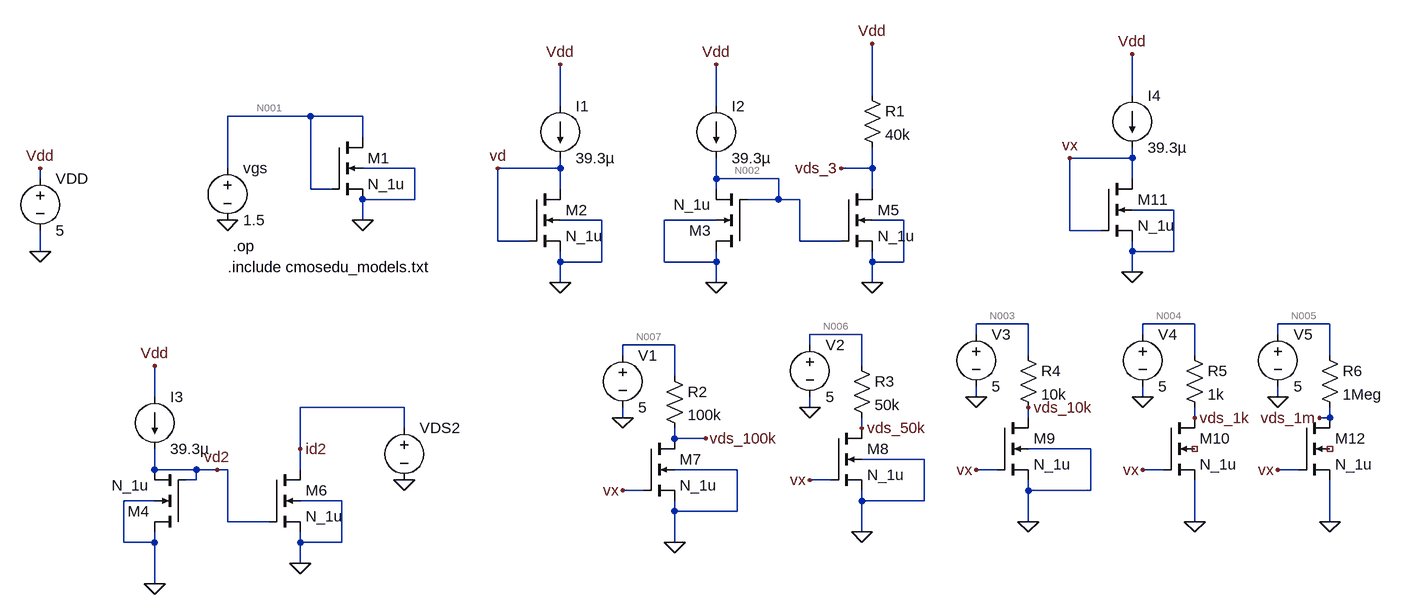
[diagram p0: schematic exe1.asc]
exe1.asc, the LTspice schematic file:
Version 4
SHEET 1 1044 680
WIRE -208 -928 -208 -1008
WIRE 192 -928 192 -992
WIRE -688 -912 -688 -976
WIRE -448 -912 -448 -976
WIRE -1072 -896 -1200 -896
WIRE -992 -896 -1072 -896
WIRE -992 -864 -992 -896
WIRE 192 -832 192 -848
WIRE 192 -832 96 -832
WIRE -1200 -816 -1200 -896
WIRE -912 -816 -992 -816
WIRE -688 -816 -688 -832
WIRE -688 -816 -784 -816
WIRE -208 -816 -208 -848
WIRE -208 -816 -256 -816
WIRE -1488 -800 -1488 -816
WIRE -448 -800 -448 -832
WIRE -352 -800 -448 -800
WIRE 192 -800 192 -832
WIRE -1072 -784 -1072 -896
WIRE -1040 -784 -1072 -784
WIRE -688 -784 -688 -816
WIRE -448 -784 -448 -800
WIRE -208 -784 -208 -816
WIRE -912 -768 -912 -816
WIRE -912 -768 -992 -768
WIRE -352 -768 -352 -800
WIRE -352 -768 -400 -768
WIRE -320 -768 -352 -768
WIRE 256 -752 192 -752
WIRE -992 -736 -992 -768
WIRE -624 -736 -688 -736
WIRE -448 -736 -528 -736
WIRE -160 -736 -208 -736
WIRE 96 -720 96 -832
WIRE 144 -720 96 -720
WIRE -784 -704 -784 -816
WIRE -736 -704 -784 -704
WIRE -320 -704 -320 -768
WIRE -256 -704 -320 -704
WIRE -1488 -688 -1488 -720
WIRE 192 -688 192 -704
WIRE 256 -688 256 -752
WIRE 256 -688 192 -688
WIRE -688 -672 -688 -688
WIRE -624 -672 -624 -736
WIRE -624 -672 -688 -672
WIRE -528 -672 -528 -736
WIRE -448 -672 -448 -688
WIRE -448 -672 -528 -672
WIRE -208 -672 -208 -688
WIRE -160 -672 -160 -736
WIRE -160 -672 -208 -672
WIRE 192 -656 192 -688
WIRE -688 -640 -688 -672
WIRE -448 -640 -448 -672
WIRE -208 -640 -208 -672
WIRE 32 -576 -48 -576
WIRE 288 -576 208 -576
WIRE 496 -576 416 -576
WIRE -224 -560 -304 -560
WIRE -48 -560 -48 -576
WIRE 208 -560 208 -576
WIRE 416 -560 416 -576
WIRE -512 -544 -592 -544
WIRE -304 -544 -304 -560
WIRE -592 -528 -592 -544
WIRE 32 -528 32 -576
WIRE 288 -528 288 -576
WIRE 496 -528 496 -576
WIRE -224 -512 -224 -560
WIRE -512 -496 -512 -544
WIRE -1312 -464 -1312 -512
WIRE -48 -464 -48 -480
WIRE 208 -464 208 -480
WIRE 416 -464 416 -480
WIRE -928 -448 -1088 -448
WIRE -304 -448 -304 -464
WIRE -592 -432 -592 -448
WIRE 32 -432 32 -448
WIRE 288 -432 288 -448
WIRE 496 -432 496 -448
WIRE 496 -432 480 -432
WIRE -928 -416 -928 -448
WIRE -224 -416 -224 -432
WIRE -512 -400 -512 -416
WIRE -464 -400 -512 -400
WIRE -1088 -384 -1088 -448
WIRE 128 -384 32 -384
WIRE -128 -368 -224 -368
WIRE -1312 -352 -1312 -384
WIRE -1248 -352 -1312 -352
WIRE -1216 -352 -1248 -352
WIRE -1200 -352 -1216 -352
WIRE -1088 -352 -1088 -384
WIRE -416 -352 -512 -352
WIRE -16 -352 -48 -352
WIRE 240 -352 208 -352
WIRE 448 -352 416 -352
WIRE -1248 -336 -1248 -352
WIRE -1248 -336 -1264 -336
WIRE -272 -336 -304 -336
WIRE -560 -320 -592 -320
WIRE 32 -320 32 -336
WIRE 128 -320 128 -384
WIRE 128 -320 32 -320
WIRE -1312 -304 -1360 -304
WIRE -1024 -304 -1088 -304
WIRE -224 -304 -224 -320
WIRE -128 -304 -128 -368
WIRE -128 -304 -224 -304
WIRE -512 -288 -512 -304
WIRE -416 -288 -416 -352
WIRE -416 -288 -512 -288
WIRE -1200 -272 -1200 -352
WIRE -1136 -272 -1200 -272
WIRE 32 -272 32 -320
WIRE 288 -272 288 -336
WIRE 496 -272 496 -336
WIRE -224 -256 -224 -304
WIRE -1360 -240 -1360 -304
WIRE -1312 -240 -1312 -256
WIRE -1312 -240 -1360 -240
WIRE -1088 -240 -1088 -256
WIRE -1024 -240 -1024 -304
WIRE -1024 -240 -1088 -240
WIRE -512 -240 -512 -288
WIRE -1088 -208 -1088 -240
WIRE -1312 -176 -1312 -240
FLAG -992 -736 0
FLAG -1200 -736 0
FLAG -1488 -688 0
FLAG -688 -640 0
FLAG -784 -816 vd
FLAG -688 -976 Vdd
FLAG -1488 -816 Vdd
FLAG -448 -640 0
FLAG -448 -976 Vdd
FLAG -208 -640 0
FLAG -208 -1008 Vdd
FLAG -256 -816 vds_3
FLAG -1312 -512 Vdd
FLAG -928 -336 0
FLAG -1312 -176 0
FLAG -1088 -208 0
FLAG -1088 -384 id2
FLAG -1216 -352 vd2
FLAG -592 -432 0
FLAG -592 -320 vx
FLAG -512 -240 0
FLAG -304 -448 0
FLAG -304 -336 vx
FLAG -224 -256 0
FLAG -48 -464 0
FLAG -48 -352 vx
FLAG 32 -272 0
FLAG 208 -464 0
FLAG 208 -352 vx
FLAG 288 -272 0
FLAG 192 -656 0
FLAG 96 -832 vx
FLAG 192 -992 Vdd
FLAG 416 -464 0
FLAG 416 -352 vx
FLAG 496 -272 0
FLAG -464 -400 vds_100k
FLAG 288 -432 vds_1k
FLAG 480 -432 vds_1m
FLAG -224 -416 vds_50k
FLAG 32 -448 vds_10k
SYMBOL nmos4 -1040 -864 R0
SYMATTR InstName M1
SYMATTR Value N_1u
SYMATTR Value2 l=1.5u w=3u
SYMBOL voltage -1200 -832 R0
SYMATTR InstName vgs
SYMATTR Value 1.5
SYMBOL current -688 -912 R0
WINDOW 123 0 0 Left 2
WINDOW 39 0 0 Left 2
SYMATTR InstName I1
SYMATTR Value 39.3µ
SYMBOL voltage -1488 -816 R0
WINDOW 123 0 0 Left 2
WINDOW 39 0 0 Left 2
SYMATTR InstName VDD
SYMATTR Value 5
SYMBOL nmos4 -736 -784 R0
SYMATTR InstName M2
SYMATTR Value N_1u
SYMATTR Value2 l=1.5u w=3u
SYMBOL current -448 -912 R0
WINDOW 123 0 0 Left 2
WINDOW 39 0 0 Left 2
SYMATTR InstName I2
SYMATTR Value 39.3µ
SYMBOL nmos4 -400 -688 R180
SYMATTR InstName M3
SYMATTR Value N_1u
SYMATTR Value2 l=1.5u w=3u
SYMBOL res -224 -944 R0
SYMATTR InstName R1
SYMATTR Value 40k
SYMBOL nmos4 -256 -784 R0
SYMATTR InstName M5
SYMATTR Value N_1u
SYMATTR Value2 l=1.5u w=6u
SYMBOL current -1312 -464 R0
SYMATTR InstName I3
SYMATTR Value 39.3µ
SYMBOL nmos4 -1264 -256 R180
SYMATTR InstName M4
SYMATTR Value N_1u
SYMATTR Value2 l=1.5u w=3u
SYMBOL voltage -928 -432 R0
WINDOW 123 0 0 Left 2
WINDOW 39 0 0 Left 2
SYMATTR InstName VDS2
SYMATTR Value ""
SYMBOL nmos4 -1136 -352 R0
SYMATTR InstName M6
SYMATTR Value N_1u
SYMATTR Value2 l=1.5u w=3u
SYMBOL nmos4 -560 -400 R0
SYMATTR InstName M7
SYMATTR Value N_1u
SYMATTR Value2 l=1.5u w=3u
SYMBOL res -528 -512 R0
SYMATTR InstName R2
SYMATTR Value 100k
SYMBOL voltage -592 -544 R0
WINDOW 123 0 0 Left 2
WINDOW 39 0 0 Left 2
SYMATTR InstName V1
SYMATTR Value 5
SYMBOL nmos4 -272 -416 R0
SYMATTR InstName M8
SYMATTR Value N_1u
SYMATTR Value2 l=1.5u w=3u
SYMBOL res -240 -528 R0
SYMATTR InstName R3
SYMATTR Value 50k
SYMBOL voltage -304 -560 R0
SYMATTR InstName V2
SYMATTR Value 5
SYMBOL nmos4 -16 -432 R0
SYMATTR InstName M9
SYMATTR Value N_1u
SYMATTR Value2 l=1.5u w=3u
SYMBOL res 16 -544 R0
SYMATTR InstName R4
SYMATTR Value 10k
SYMBOL voltage -48 -576 R0
WINDOW 123 0 0 Left 2
WINDOW 39 0 0 Left 2
SYMATTR InstName V3
SYMATTR Value 5
SYMBOL nmos4 240 -432 R0
SYMATTR InstName M10
SYMATTR Value N_1u
SYMATTR Value2 l=1.5u w=3u
SYMBOL res 272 -544 R0
SYMATTR InstName R5
SYMATTR Value 1k
SYMBOL voltage 208 -576 R0
WINDOW 123 0 0 Left 2
WINDOW 39 0 0 Left 2
SYMATTR InstName V4
SYMATTR Value 5
SYMBOL current 192 -928 R0
WINDOW 123 0 0 Left 2
WINDOW 39 0 0 Left 2
SYMATTR InstName I4
SYMATTR Value 39.3µ
SYMBOL nmos4 144 -800 R0
SYMATTR InstName M11
SYMATTR Value N_1u
SYMATTR Value2 l=1.5u w=3u
SYMBOL nmos4 448 -432 R0
SYMATTR InstName M12
SYMATTR Value N_1u
SYMATTR Value2 l=1.5u w=3u
SYMBOL res 480 -544 R0
SYMATTR InstName R6
SYMATTR Value 1Meg
SYMBOL voltage 416 -576 R0
WINDOW 123 0 0 Left 2
WINDOW 39 0 0 Left 2
SYMATTR InstName V5
SYMATTR Value 5
TEXT -1200 -664 Left 2 !.include cmosedu_models.txt
TEXT -1192 -696 Left 2 !.op

The netlist it stands for:
* exe1.asc
M1 N001 N001 0 0 N_1u l=1.5u w=3u
vgs N001 0 1.5
I1 Vdd vd 39.3µ
VDD Vdd 0 5
M2 vd vd 0 0 N_1u l=1.5u w=3u
I2 Vdd N002 39.3µ
M3 0 N002 N002 0 N_1u l=1.5u w=3u
R1 Vdd vds_3 40k
M5 vds_3 N002 0 0 N_1u l=1.5u w=6u
I3 Vdd vd2 39.3µ
M4 0 vd2 vd2 0 N_1u l=1.5u w=3u
VDS2 id2 0
M6 id2 vd2 0 0 N_1u l=1.5u w=3u
M7 vds_100k vx 0 0 N_1u l=1.5u w=3u
R2 N007 vds_100k 100k
V1 N007 0 5
M8 vds_50k vx 0 0 N_1u l=1.5u w=3u
R3 N006 vds_50k 50k
V2 N006 0 5
M9 vds_10k vx 0 0 N_1u l=1.5u w=3u
R4 N003 vds_10k 10k
V3 N003 0 5
M10 vds_1k vx 0 NC_01 N_1u l=1.5u w=3u
R5 N004 vds_1k 1k
V4 N004 0 5
I4 Vdd vx 39.3µ
M11 vx vx 0 0 N_1u l=1.5u w=3u
M12 vds_1m vx 0 NC_02 N_1u l=1.5u w=3u
R6 N005 vds_1m 1Meg
V5 N005 0 5
.model NMOS NMOS
.model PMOS PMOS
.lib standard.mos
.include cmosedu_models.txt
.op
.backanno
.end

* Results of the author's LTspice run, read from the files saved beside the schematic
* Operating Point:
*   V(n001) = 1.5 V
*   V(vdd) = 5 V
*   V(vd) = 1.5 V
*   V(n002) = 1.5 V
*   V(vds_3) = 1.473 V
*   V(vd2) = 1.5 V
*   V(id2) = 0 V
*   V(vds_100k) = 1.11 V
*   V(vx) = 1.5 V
*   V(n007) = 5 V
*   V(vds_50k) = 2.979 V
*   V(n006) = 5 V
*   V(vds_10k) = 4.587 V
*   V(n003) = 5 V
*   V(vds_1k) = 4.953 V
*   V(n004) = 5 V
*   V(vds_1m) = 29.68 mV
*   V(n005) = 5 V
*   Id(M12) = 4.97 µA
*   Ig(M12) = 0 A
*   Ib(M12) = 0 A
*   Is(M12) = -4.97 µA
*   Id(M11) = 39.3 µA
*   Ig(M11) = 0 A
*   Ib(M11) = -1.51 pA
*   Is(M11) = -39.3 µA
*   Id(M10) = 46.64 µA
*   Ig(M10) = 0 A
*   Ib(M10) = 0 A
*   Is(M10) = -46.64 µA
*   Id(M9) = 41.35 µA
*   Ig(M9) = 0 A
*   Ib(M9) = -4.597 pA
*   Is(M9) = -41.35 µA
*   Id(M8) = 40.42 µA
*   Ig(M8) = 0 A
*   Ib(M8) = -2.989 pA
*   Is(M8) = -40.42 µA
*   Id(M7) = 38.9 µA
*   Ig(M7) = 0 A
*   Ib(M7) = -1.12 pA
*   Is(M7) = -38.9 µA
*   Id(M6) = 0 A
*   Ig(M6) = 0 A
*   Ib(M6) = 0 A
*   Is(M6) = 0 A
*   Id(M4) = -39.3 µA
*   Ig(M4) = 0 A
*   Ib(M4) = -1.51 pA
*   Is(M4) = 39.3 µA
*   Id(M5) = 88.18 µA
*   Ig(M5) = 0 A
*   Ib(M5) = -1.483 pA
*   Is(M5) = -88.18 µA
*   Id(M3) = -39.3 µA
*   Ig(M3) = 0 A
*   Ib(M3) = -1.51 pA
*   Is(M3) = 39.3 µA
*   Id(M2) = 39.3 µA
*   Ig(M2) = 0 A
*   Ib(M2) = -1.51 pA
*   Is(M2) = -39.3 µA
*   Id(M1) = 39.3 µA
*   Ig(M1) = 0 A
*   Ib(M1) = -1.51 pA
*   Is(M1) = -39.3 µA
*   I(I4) = 39.3 µA
*   I(I3) = 39.3 µA
*   I(I2) = 39.3 µA
*   I(I1) = 39.3 µA
*   I(R6) = 4.97 µA
*   I(R5) = 46.64 µA
*   I(R4) = 41.35 µA
*   I(R3) = 40.42 µA
*   I(R2) = 38.9 µA
*   I(R1) = 88.19 µA
*   I(V5) = -4.97 µA
*   I(V4) = -46.64 µA
*   I(V3) = -41.35 µA
*   I(V2) = -40.42 µA
*   I(V1) = -38.9 µA
*   I(Vds2) = 0 A
*   I(Vdd) = -245.4 µA
*   I(Vgs) = -39.3 µA
* From the log:
*   Semiconductor Device Operating Points:
*                           --- MOSFET Transistors ---
*   Name:          m12         m11         m10         m9          m8
*   Model:        n_1u        n_1u        n_1u        n_1u        n_1u
*   Id:          4.97e-06    3.93e-05    4.66e-05    4.13e-05    4.04e-05
*   Vgs:         1.50e+00    1.50e+00    1.50e+00    1.50e+00    1.50e+00
*   Vds:         2.97e-02    1.50e+00    4.95e+00    4.59e+00    2.98e+00
*   Vbs:         1.37e-02    0.00e+00    1.59e-01    0.00e+00    0.00e+00
*   Vth:         8.86e-01    8.90e-01    8.41e-01    8.90e-01    8.90e-01
*   Vdsat:       4.77e-01    4.74e-01    4.99e-01    4.74e-01    4.74e-01
*   Gm:          7.14e-06    1.01e-04    1.11e-04    1.07e-04    1.05e-04
*   Gds:         1.60e-04    4.28e-06    4.69e-06    4.05e-06    4.09e-06
*   Gmb:         2.63e-06    3.45e-05    3.24e-05    3.64e-05    3.56e-05
*   Cbd:         0.00e+00    0.00e+00    0.00e+00    0.00e+00    0.00e+00
*   Cbs:         0.00e+00    0.00e+00    0.00e+00    0.00e+00    0.00e+00
*   Cgsov:       6.00e-16    6.00e-16    6.00e-16    6.00e-16    6.00e-16
*   Cgdov:       6.00e-16    6.00e-16    6.00e-16    6.00e-16    6.00e-16
*   Cgbov:       1.30e-16    1.30e-16    1.30e-16    1.30e-16    1.30e-16
*   Cgs:         3.44e-15    4.49e-15    4.49e-15    4.49e-15    4.49e-15
*   Cgd:         3.29e-15    0.00e+00    0.00e+00    0.00e+00    0.00e+00
*   Cgb:         0.00e+00    0.00e+00    0.00e+00    0.00e+00    0.00e+00
*   Name:          m7          m6          m4          m5          m3
*   Model:        n_1u        n_1u        n_1u        n_1u        n_1u
*   Id:          3.89e-05    0.00e+00   -3.93e-05    8.82e-05   -3.93e-05
*   Vgs:         1.50e+00    1.50e+00    0.00e+00    1.50e+00    0.00e+00
*   Vds:         1.11e+00    0.00e+00   -1.50e+00    1.47e+00   -1.50e+00
*   Vbs:         0.00e+00    0.00e+00   -1.50e+00    0.00e+00   -1.50e+00
*   Vth:         8.90e-01    8.90e-01    8.90e-01    8.57e-01    8.90e-01
*   Vdsat:       4.74e-01    4.74e-01    4.74e-01    5.11e-01    4.74e-01
*   Gm:          1.00e-04    0.00e+00    1.01e-04    2.14e-04    1.01e-04
*   Gds:         4.45e-06    1.73e-04    4.28e-06    1.01e-05    4.28e-06
*   Gmb:         3.41e-05    0.00e+00    3.45e-05    6.22e-05    3.45e-05
*   Cbd:         0.00e+00    0.00e+00    0.00e+00    0.00e+00    0.00e+00
*   Cbs:         0.00e+00    0.00e+00    0.00e+00    0.00e+00    0.00e+00
*   Cgsov:       6.00e-16    6.00e-16    6.00e-16    1.20e-15    6.00e-16
*   Cgdov:       6.00e-16    6.00e-16    6.00e-16    1.20e-15    6.00e-16
*   Cgbov:       1.30e-16    1.30e-16    1.30e-16    1.30e-16    1.30e-16
*   Cgs:         4.49e-15    3.37e-15    0.00e+00    8.98e-15    0.00e+00
*   Cgd:         0.00e+00    3.37e-15    4.49e-15    0.00e+00    4.49e-15
*   Cgb:         0.00e+00    0.00e+00    0.00e+00    0.00e+00    0.00e+00
*   Name:          m2          m1
*   Model:        n_1u        n_1u
*   Id:          3.93e-05    3.93e-05
*   Vgs:         1.50e+00    1.50e+00
*   Vds:         1.50e+00    1.50e+00
*   Vbs:         0.00e+00    0.00e+00
*   Vth:         8.90e-01    8.90e-01
*   Vdsat:       4.74e-01    4.74e-01
*   Gm:          1.01e-04    1.01e-04
*   Gds:         4.28e-06    4.28e-06
*   Gmb:         3.45e-05    3.45e-05
*   Cbd:         0.00e+00    0.00e+00
*   Cbs:         0.00e+00    0.00e+00
*   Cgsov:       6.00e-16    6.00e-16
*   Cgdov:       6.00e-16    6.00e-16
*   Cgbov:       1.30e-16    1.30e-16
*   Cgs:         4.49e-15    4.49e-15
*   Cgd:         0.00e+00    0.00e+00
*   Cgb:         0.00e+00    0.00e+00